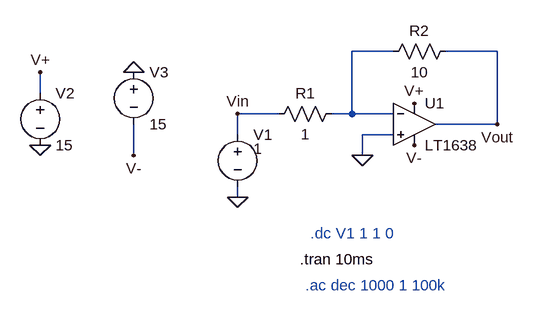
[diagram p0: schematic IQAMP.asc]
IQAMP.asc, the LTspice schematic file:
Version 4
SHEET 1 880 680
WIRE 384 192 320 192
WIRE 544 192 464 192
WIRE -160 256 -160 224
WIRE 208 288 144 288
WIRE 320 288 320 192
WIRE 320 288 288 288
WIRE 384 288 320 288
WIRE 544 304 544 192
WIRE 544 304 448 304
WIRE 144 320 144 288
WIRE 384 320 336 320
WIRE -16 352 -16 304
WIRE 336 352 336 320
WIRE 144 416 144 400
FLAG 336 352 0
FLAG 144 416 0
FLAG 544 304 Vout
FLAG 144 288 Vin
FLAG -160 336 0
FLAG -160 224 V+
FLAG 416 272 V+
FLAG 416 336 V-
FLAG -16 224 0
FLAG -16 352 V-
SYMBOL Res 304 272 R90
WINDOW 0 0 56 VBottom 2
WINDOW 3 32 56 VTop 2
SYMATTR InstName R1
SYMATTR Value 1
SYMBOL Voltage 144 304 R0
WINDOW 3 24 38 Left 2
SYMATTR Value 1
SYMATTR Value2 AC 0 0
SYMATTR InstName V1
SYMBOL Res 480 176 R90
WINDOW 0 0 56 VBottom 2
WINDOW 3 32 56 VTop 2
SYMATTR InstName R2
SYMATTR Value 10
SYMBOL Voltage -160 240 R0
SYMATTR InstName V2
SYMATTR Value 15
SYMBOL Voltage -16 208 R0
SYMATTR InstName V3
SYMATTR Value 15
SYMBOL OpAmps/LT1638 416 240 R0
SYMATTR InstName U1
TEXT 240 512 Left 2 !.tran 10ms
TEXT 248 552 Left 2 ;.ac dec 1000 1 100k
TEXT 256 472 Left 2 ;.dc V1 1 1 0

The netlist it stands for:
* IQAMP.asc
R1 N001 Vin 1
V1 Vin 0 1 AC 0 0
R2 Vout N001 10
V2 V+ 0 15
V3 0 V- 15
XU1 0 N001 V+ V- Vout LT1638  ; pins In+ In- V+ V- OUT
.tran 10ms
* .ac dec 1000 1 100k
* .dc V1 1 1 0
.backanno
.end